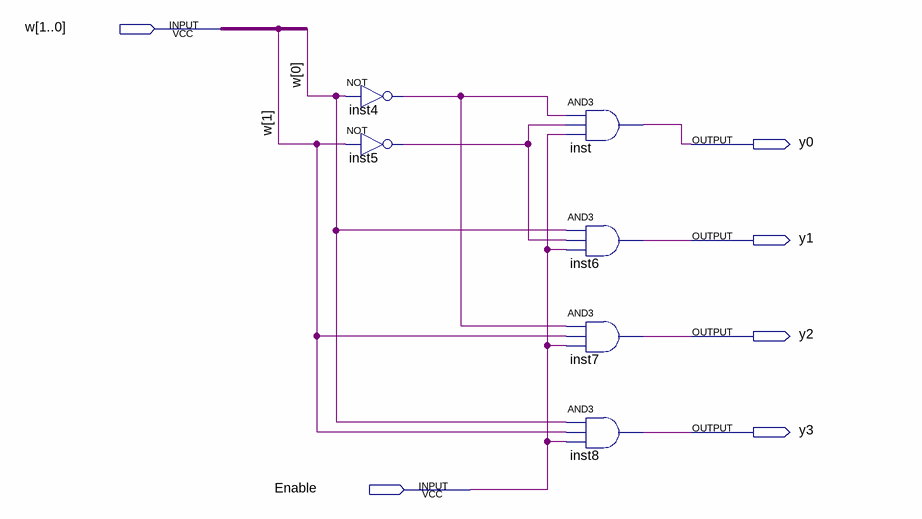
[diagram p0: schematic sheet]
// Quartus schematic 2x4Decoder.bdf as structural Verilog: 6 symbols, 6 pins
module \2x4Decoder  (
  input  [1:0] w,
  input  Enable,
  output y0,
  output y1,
  output y2,
  output y3
);

  wire inst4_out, inst5_out;

  not inst4 (inst4_out, w[0]);
  not inst5 (inst5_out, w[1]);
  and inst (y0, inst4_out, inst5_out, Enable);
  and inst6 (y1, w[0], inst5_out, Enable);
  and inst7 (y2, inst4_out, w[1], Enable);
  and inst8 (y3, w[0], w[1], Enable);
endmodule
